# EAGLE design Carte_alim_Mark1 (EAGLE 6.1)
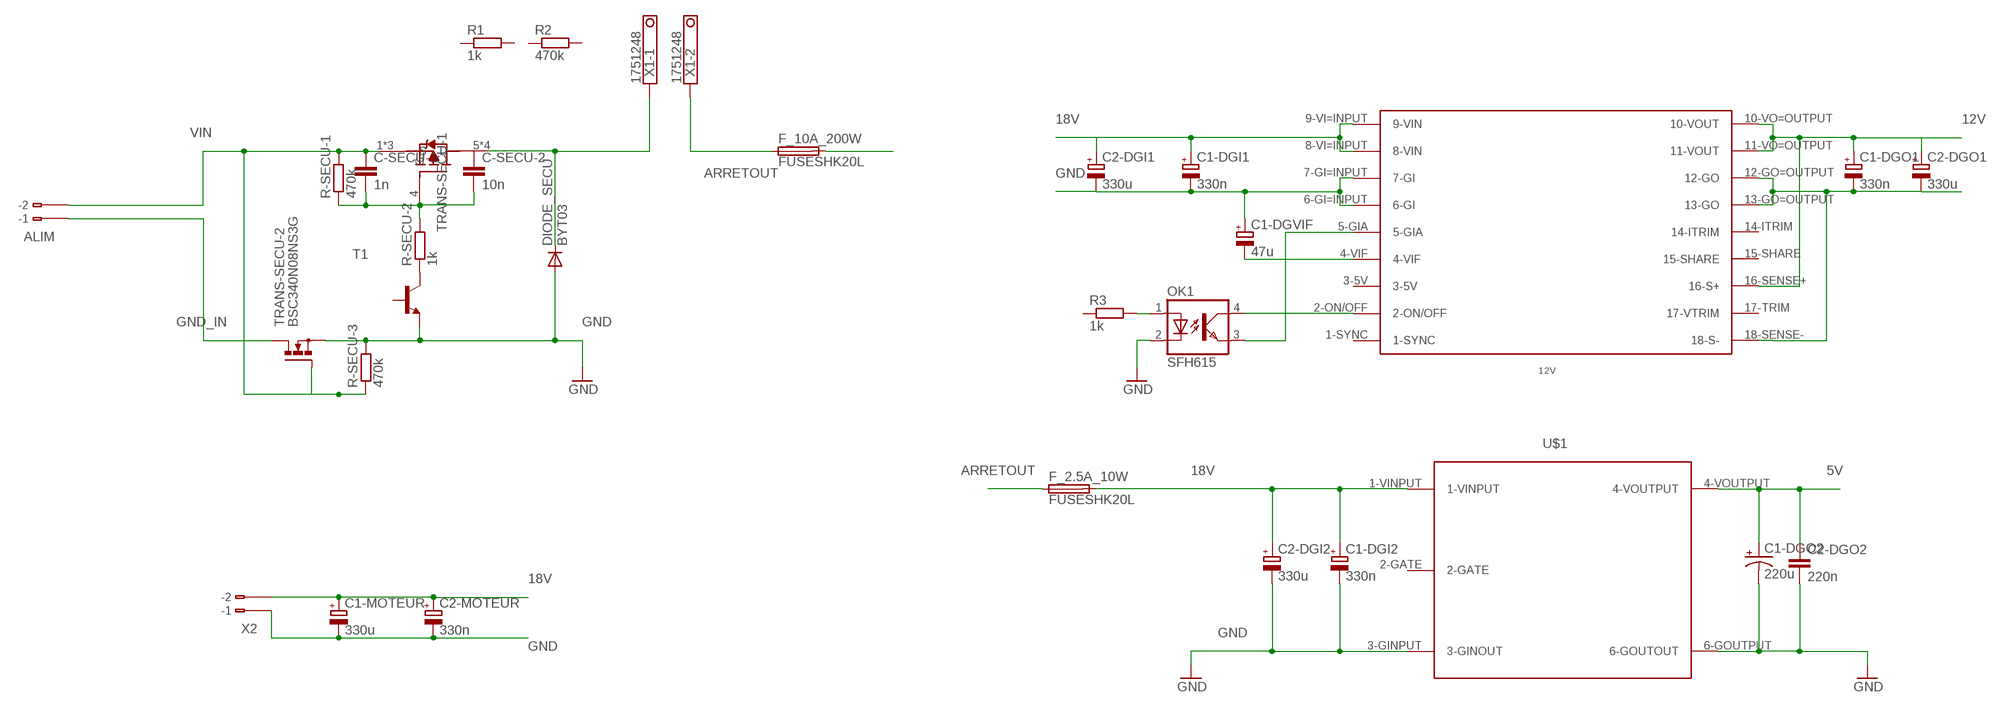
[diagram p0: schematic, sheet 1]

## Parts
12V  MGDS200MGDS200  [MGDS200]
ALIM  233-102  [233-102]
C1-DGI1  330n  CPOL-EUE2-5  [E2-5]
C1-DGI2  330n  CPOL-EUE2-5  [E2-5]
C1-DGO1  330n  CPOL-EUE2-5  [E2-5]
C1-DGO2  220u  CPOL-US085CS-1AW  [085CS_1AW]
C1-DGVIF  47u  CPOL-EUE2-5  [E2-5]
C1-MOTEUR  330u  CPOL-EUE3.5-10  [E3,5-10]
C2-DGI1  330u  CPOL-EUE3.5-10  [E3,5-10]
C2-DGI2  330u  CPOL-EUE3.5-10  [E3,5-10]
C2-DGO1  330u  CPOL-EUE3.5-10  [E3,5-10]
C2-DGO2  220n  C-EUC2012  [C2012]
C2-MOTEUR  330n  CPOL-EUE2-5  [E2-5]
C-SECU-1  1n  C-EU025-024X044  [C025-024X044]
C-SECU-2  10n  C-EU075-032X103  [C075-032X103]
DIODE_SECU  BYT03  [DO27-15]
F_2.5A_10W  FUSESHK20L  [SHK20L]
F_10A_200W  FUSESHK20L  [SHK20L]
OK1  SFH615  [DIL04]
R1  1k  R-EU_R2012  [R2012]
R2  470k  R-EU_R2012  [R2012]
R3  1k  R-EU_R2012  [R2012]
R-SECU-1  470k  R-EU_0207/7  [0207/7]
R-SECU-2  1k  R-EU_0207/7  [0207/7]
R-SECU-3  470k  R-EU_0207/7  [0207/7]
T1  BF844-NPN-TO92-CBE  [TO92-CBE]
TRANS-SECU-1  BSC080PG-TDSON  [PG-TDSON-8]
TRANS-SECU-2  BSC340N08NS3G  [PG-TDSON-8]
U$1  MGDS10SINGLE  [MGDS10]
X1  1751248  [1751248]
X2  233-102  [233-102]

## Nets
5V: C1-DGO2.+ C2-DGO2.1 U$1.4-VOUTPUT
12V: 12V.10-VO=OUTPUT(10-VOUT) 12V.11-VO=OUTPUT(11-VOUT) 12V.16-SENSE+(16-S+) C1-DGO1.+ C2-DGO1.+
18V: 12V.8-VI=INPUT(8-VIN) 12V.9-VI=INPUT(9-VIN) C1-DGI1.+ C1-DGI2.+ C1-MOTEUR.+ C2-DGI1.+ C2-DGI2.+ C2-MOTEUR.+ F_2.5A_10W.2A F_10A_200W.2A U$1.1-VINPUT X2.B2(B-2)
ARRETOUT: F_2.5A_10W.1A F_10A_200W.1A X1.2
GND: 12V.6-GI=INPUT(6-GI) 12V.7-GI=INPUT(7-GI) 12V.12-GO=OUTPUT(12-GO) 12V.13-GO=OUTPUT(13-GO) 12V.18-SENSE-(18-S-) C1-DGI1.- C1-DGI2.- C1-DGO1.- C1-DGO2.- C1-DGVIF.+ C1-MOTEUR.- C2-DGI1.- C2-DGI2.- C2-DGO1.- C2-DGO2.2 C2-MOTEUR.- DIODE_SECU.A OK1.2(C) R-SECU-3.2 T1.E TRANS-SECU-2.1(S) TRANS-SECU-2.2(S) TRANS-SECU-2.3(S) U$1.3-GINPUT(3-GINOUT) U$1.6-GOUTPUT(6-GOUTOUT) X2.B1(B-1)
GND_IN: ALIM.B1(B-1) TRANS-SECU-2.5(D) TRANS-SECU-2.6(D) TRANS-SECU-2.7(D) TRANS-SECU-2.8(D)
N$1: DIODE_SECU.C TRANS-SECU-1.5(D) TRANS-SECU-1.6(D) TRANS-SECU-1.7(D) TRANS-SECU-1.8(D) X1.1
N$2: OK1.1(A) R3.2
N$3: C-SECU-1.2 C-SECU-2.2 R-SECU-1.1 R-SECU-2.2 TRANS-SECU-1.4(G)
N$4: R-SECU-2.1 T1.C
N$5: 12V.4-VIF C1-DGVIF.-
N$6: 12V.5-GIA OK1.3(EMIT)
N$7: 12V.2-ON/OFF OK1.4(COL)
VIN: ALIM.B2(B-2) C-SECU-1.1 R-SECU-1.2 R-SECU-3.1 TRANS-SECU-1.1(S) TRANS-SECU-1.2(S) TRANS-SECU-1.3(S) TRANS-SECU-2.4(G)
Unconnected: 12V.1-SYNC 12V.3-5V 12V.14-ITRIM 12V.15-SHARE 12V.17-TRIM(17-VTRIM) ALIM.A1(-1) ALIM.A2(-2) C-SECU-2.1 R1.1 R1.2 R2.1 R2.2 R3.1 T1.B TRANS-SECU-2.TH U$1.2-GATE X2.A1(-1) X2.A2(-2)

## Library data of the parts
12V = GAIA:MGDS200: MGDS200 GAIA Converter
ALIM X2 = con-wago:233-102: WAGO Cage Clamp; MPN: 233-102; OC_FARNELL: unknown; OC_NEWARK: 28K9044
C1-DGI1 C1-DGI2 C1-DGO1 C1-DGVIF C1-MOTEUR C2-DGI1 C2-DGI2 C2-DGO1 C2-MOTEUR = rcl:CPOL-EU: POLARIZED CAPACITOR, European symbol
C1-DGO2 = rcl:CPOL-US: POLARIZED CAPACITOR, American symbol
C2-DGO2 C-SECU-1 C-SECU-2 = rcl:C-EU: CAPACITOR, European symbol
DIODE_SECU = diode:BYT03: DIODE ultra fast
F_2.5A_10W F_10A_200W = fuse:FUSE: Fuse; OC_FARNELL: unknown; OC_NEWARK: unknown
OK1 = optocoupler:SFH615: SIEMENS OPTO COUPLER; MPN: SFH615A-2; OC_FARNELL: 1045382; OC_NEWARK: 97K9544
R1-R3 R-SECU-1-R-SECU-3 = resistor:R-EU_: RESISTOR, European symbol
T1 = transistor:*-NPN-: NPN Transistror BF959 corrected 2008.03.06
TRANS-SECU-1 = BSC080:BSC080
TRANS-SECU-2 = transistor-power:BSC340N08NS3G: OptiMOS TM 3 Power-Transistor BSC340N08NS3 G Source: Data sheet <http://www.infineon.com/dgdl/BSC340N08NS3G_rev2.4.pdf?folderId=db3a304313b8b5a60113cee8763b02d7&fileId=db3a30431add1d95011ae81c21f2563a>
U$1 = MGDS10:MGDS10: MGDS10 Gaia converter
X1 = con-phoenix-350:1751248: MKDS 1/ 2-3,5 Printklemme Nennstrom: 10 A Bemessungsspannung: 160 V Raster: 3,5 mm Polzahl: 2 Montageart: Löten Anschlussart: Schraubanschluss Anschlussrichtung vom Leiter zur Platine: 0° Source: http://eshop.phoenixcontact.com .. 1751248.pdf; OC_FARNELL: unknown; OC_NEWARK: unknown

## Board
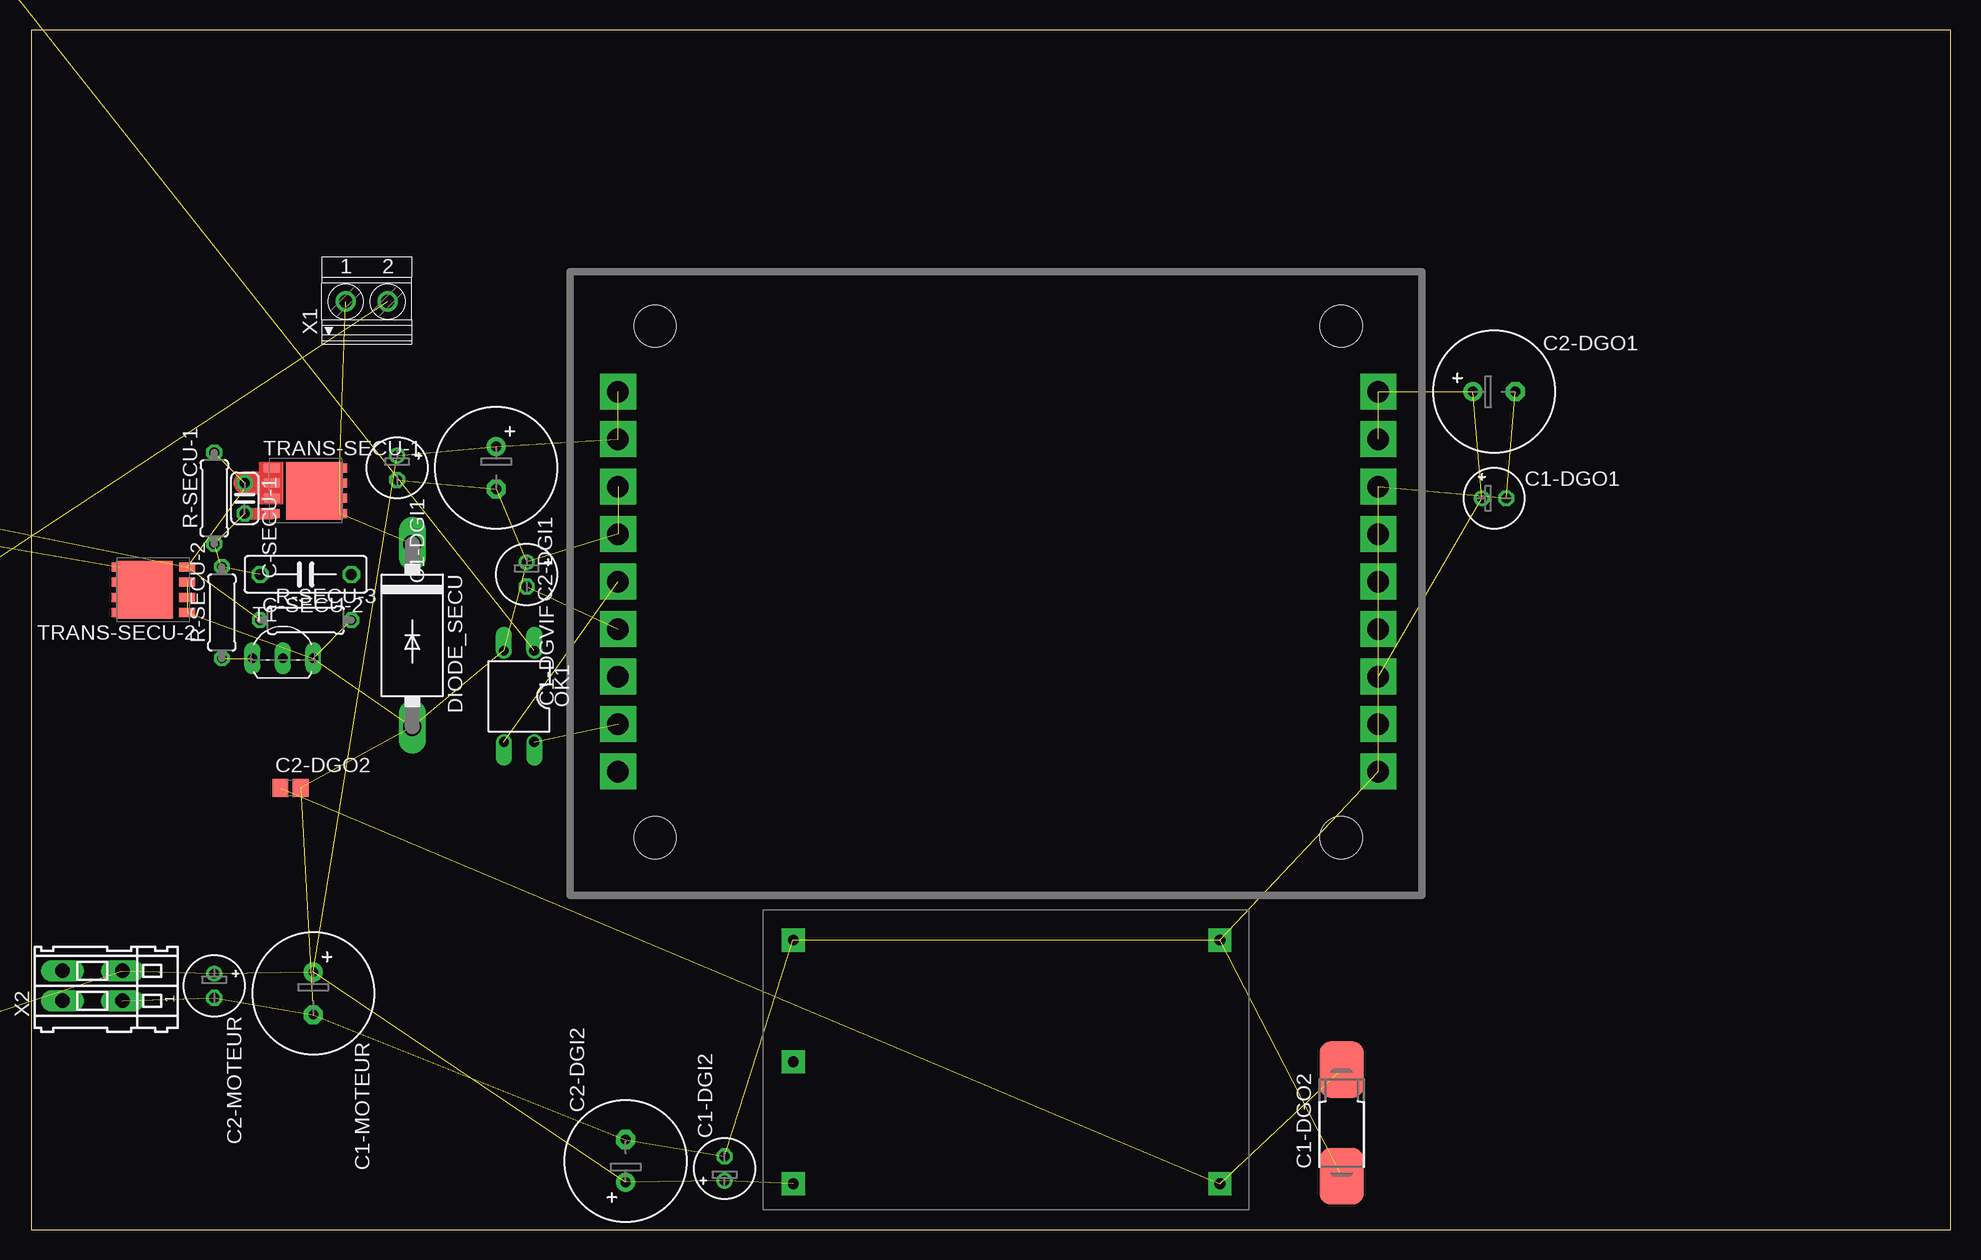
[diagram p1: board, top side]
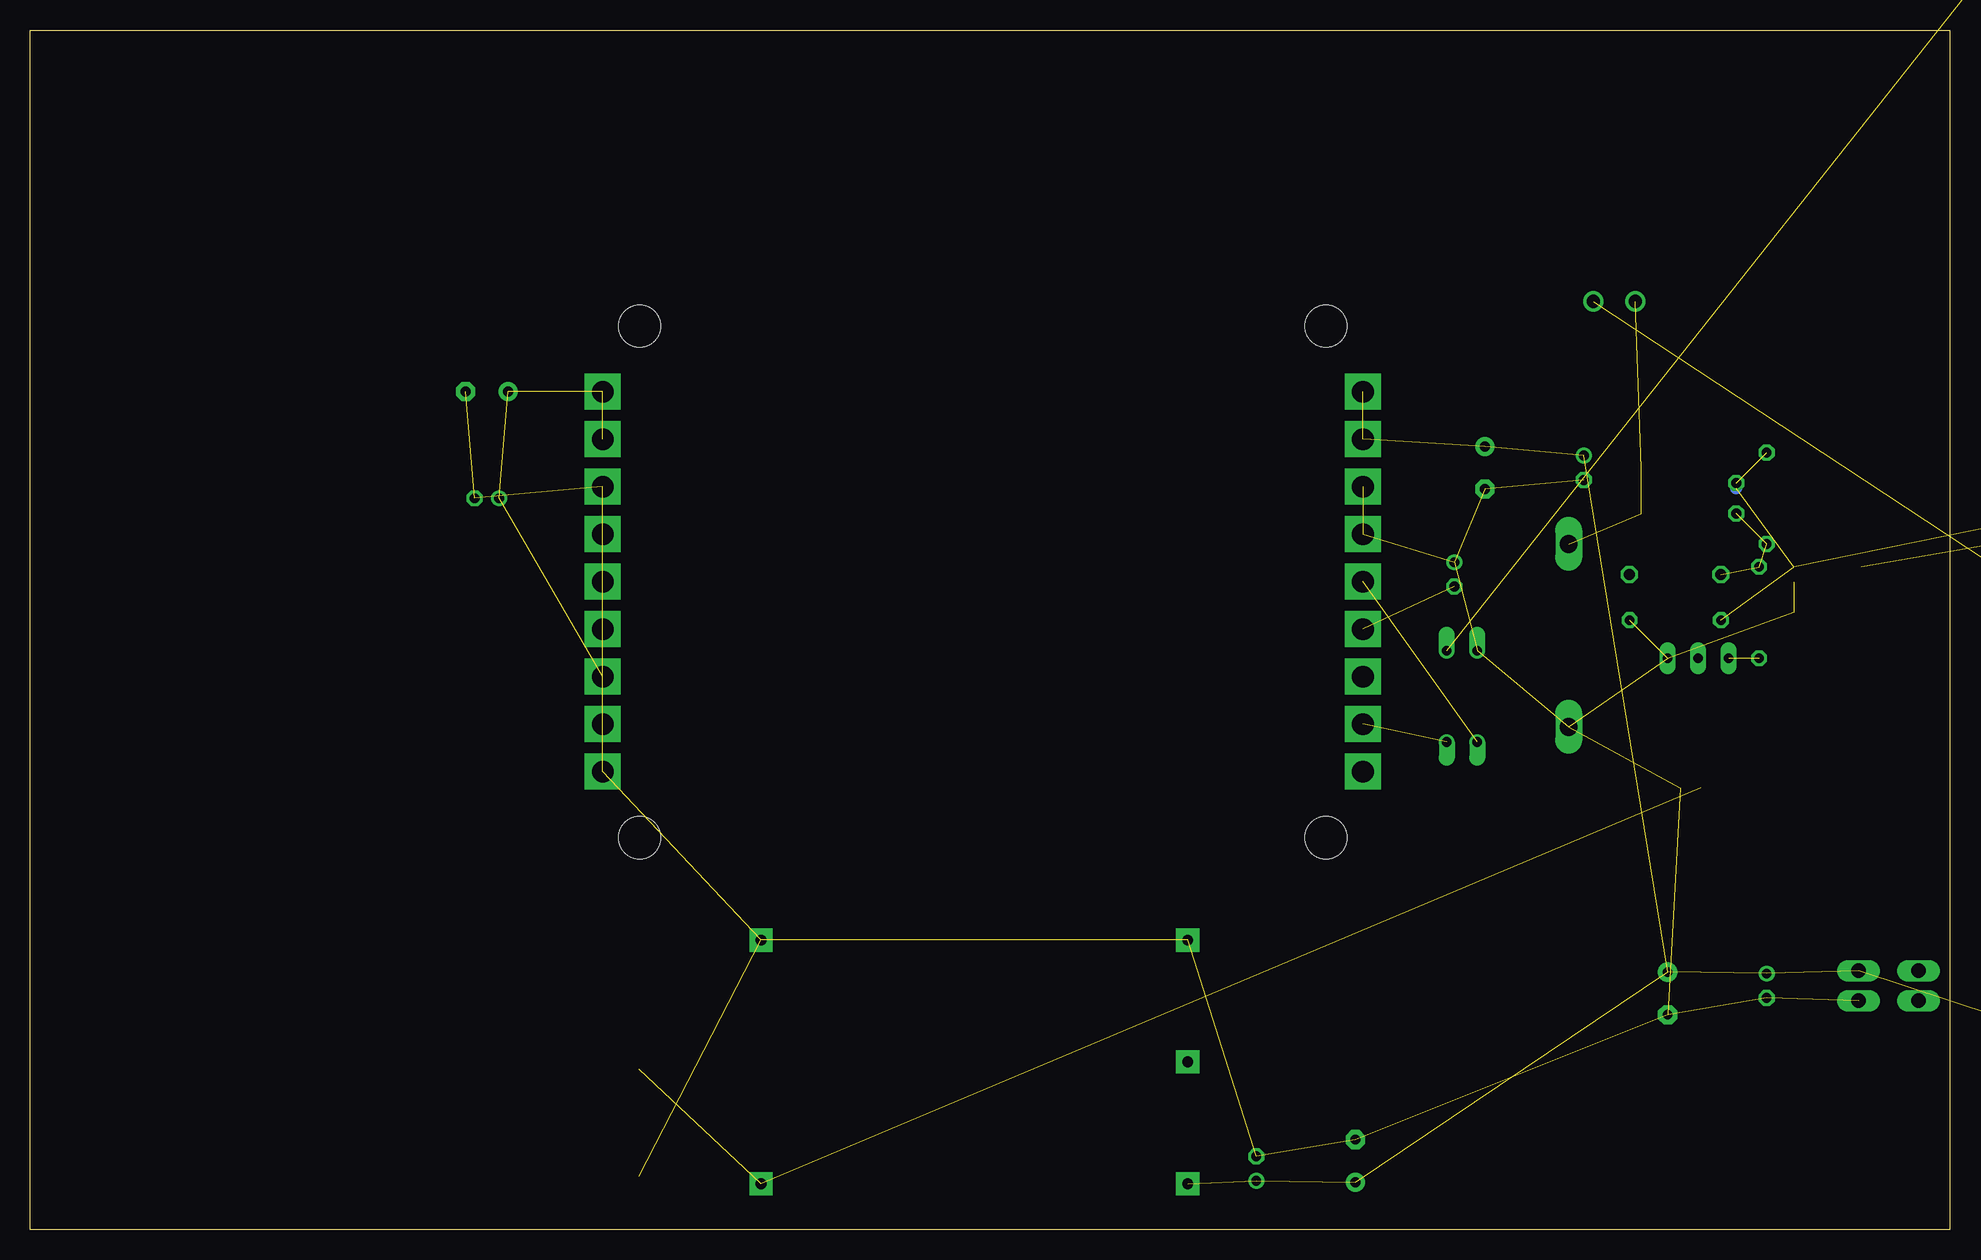
[diagram p2: board, bottom side, seen from below]

Size 160 x 100 mm. Coordinates in mm from the lower left corner, seen from the top.
Outline: 0,0 160,0 160,100 0,100 0,0
Copper layers (1*16): Top 0.035mm / dielectric 1.5mm / Bottom 0.035mm
Design rules: minimum track width 10mil, minimum drill 24mil, track to track 8mil, track to pad 8mil, pad to pad 8mil, via to via 8mil, smd to smd 8mil, copper to edge 40mil, drill to drill 8mil, minimum pad ring 10mil, minimum via ring 8mil, stop-mask expansion 4mil, vias tented up to drill 0mil, thermal gap 10mil

### Footprints (pad centres in the part's own frame; a part is rotated, then mirrored left to right if it is on the bottom)
MGDS200 = drill 1.8 pad 3 square: 1-SYNC 0,-31.68; 2-ON/OFF 0,-27.72; 3-5V 0,-23.76; 4-VIF 0,-19.8; 5-GIA 0,-15.84; 6-GI=INPUT 0,-11.88; 7-GI=INPUT 0,-7.92; 8-VI=INPUT 0,-3.96; 9-VI=INPUT 0,0; 10-VO=OUTPUT 63.36,0; 11-VO=OUTPUT 63.36,-3.96; 12-GO=OUTPUT 63.36,-7.92; 13-GO=OUTPUT 63.36,-11.88; 14-ITRIM 63.36,-15.84; 15-SHARE 63.36,-19.8; 16-SENSE+ 63.36,-23.76; 17-TRIM 63.36,-27.72; 18-SENSE- 63.36,-31.68 | hole 3.5: 3.08,5.47; 3.08,-37.18; 60.28,5.47; 60.28,-37.18
233-102 = drill 1.2 long: A1 -1.25,2.5; A2 1.25,2.5; B1 -1.25,-2.5; B2 1.25,-2.5
E2-5 = drill 0.813 pad 1.27: + -1.016,0 | drill 0.813 pad 1.27 octagon: - 1.016,0
085CS_1AW = smd 4.7 x 3.7: + 4.45,0; - -4.45,0
E3,5-10 = drill 0.813 pad 1.6: + -1.778,0 | drill 0.813 pad 1.6 octagon: - 1.778,0
C2012 = smd 1.3 x 1.5: 1 -0.85,0; 2 0.85,0
C025-024X044 = drill 0.813 octagon: 1 -1.27,0; 2 1.27,0
C075-032X103 = drill 0.914 octagon: 1 -3.81,0; 2 3.81,0
DO27-15 = drill 1.499 long: A 7.62,0; C -7.62,0
SHK20L = drill 1.321 pad 2.54 long: 1A -10.414,0; 1B -5.334,0; 2A 10.414,0; 2B 5.334,0
DIL04 = drill 0.813 offset: 1 -1.27,-3.81; 2 1.27,-3.81; 3 1.27,3.81; 4 -1.27,3.81
R2012 = smd 1.3 x 1.5: 1 -0.85,0; 2 0.85,0
0207/7 = drill 0.813 octagon: 1 -3.81,0; 2 3.81,0
TO92-CBE = drill 0.813 long: B 0,0; C -2.54,0; E 2.54,0
PG-TDSON-8 = smd 1.3 x 0.75: 1 -2.825,1.905; 2 -2.825,0.635; 3 -2.825,-0.635; 4 -2.825,-1.905; 5 2.825,-1.905; 6 2.825,-0.635; 7 2.825,0.635; 8 2.825,1.905 | smd 4.7 x 4.8: TH 0.725,0
MGDS10 = drill 0.9 pad 1.93 square: 1-VINPUT 20.32,0; 2-GATE 10.16,0; 3-GINPUT 0,0; 4-VOUTPUT 20.32,35.56; 6-GOUTPUT 0,35.56
1751248 = drill 1.1 pad 1.7: 1 -1.75,-0.1; 2 1.75,-0.1

### Placement (x,y rotation side)
12V  48.9,69.85 0 top
ALIM  -39.92,64.23 90 top  (outside the outline)
C1-DGI1  30.48,63.5 270 top
C1-DGI2  57.78,5.08 90 top
C1-DGO1  121.92,60.96 0 top
C1-DGO2  109.22,8.89 90 top
C1-DGVIF  41.27,54.61 270 top
C1-MOTEUR  23.5,19.68 270 top
C2-DGI1  38.73,63.5 270 top
C2-DGI2  49.53,5.71 90 top
C2-DGO1  121.92,69.85 0 top
C2-DGO2  21.59,36.83 0 top
C2-MOTEUR  15.24,20.32 270 top
C-SECU-1  17.78,60.96 270 top
C-SECU-2  22.86,54.61 180 top
DIODE_SECU  31.75,49.53 270 top
F_2.5A_10W  -86.5,-17.5 0 top  (outside the outline)
F_10A_200W  -86.5,-6 0 top  (outside the outline)
OK1  40.64,44.45 180 top
R1  -96.52,110.49 0 top  (outside the outline)
R2  -91.44,110.49 0 top  (outside the outline)
R3  -15.24,119.38 0 top  (outside the outline)
R-SECU-1  15.24,60.96 90 top
R-SECU-2  15.88,51.44 90 top
R-SECU-3  22.86,50.8 0 top
T1  20.95,47.62 0 top
TRANS-SECU-1  22.86,61.59 0 top
TRANS-SECU-2  10.16,53.34 180 top
U$1  63.5,24.13 270 top
X1  27.94,77.47 0 top
X2  5.08,20.32 90 top

### Tracks (layer width: path | path; a pad name or v marks a point on that pad's centre or on a via)
5V  (2 unrouted)
12V  (4 unrouted)
18V  (11 unrouted)
ARRETOUT  (2 unrouted)
GND  (25 unrouted)
GND_IN  (1 unrouted)
N$1  (5 unrouted)
N$2  (1 unrouted)
N$3  (3 unrouted)
  Top 1.016: C-SECU-1.2 TRANS-SECU-1.4
N$4  (1 unrouted)
N$5  (1 unrouted)
N$6  (1 unrouted)
N$7  (1 unrouted)
VIN  (4 unrouted)
  Top 1.016: TRANS-SECU-1.1 20,63.5 20,63 20,62.27 TRANS-SECU-1.2 TRANS-SECU-1.3
  Top 1.93: TRANS-SECU-1.2 C-SECU-1.1
  Bottom 1.016: C-SECU-1.1 17.78,61.78
(copper drawn outside any net)
  shapes: Top area x1